# Altium schematic sheet Microcontroller_STM32F1011.SchDoc: Microcontroller STM32F101
size A4
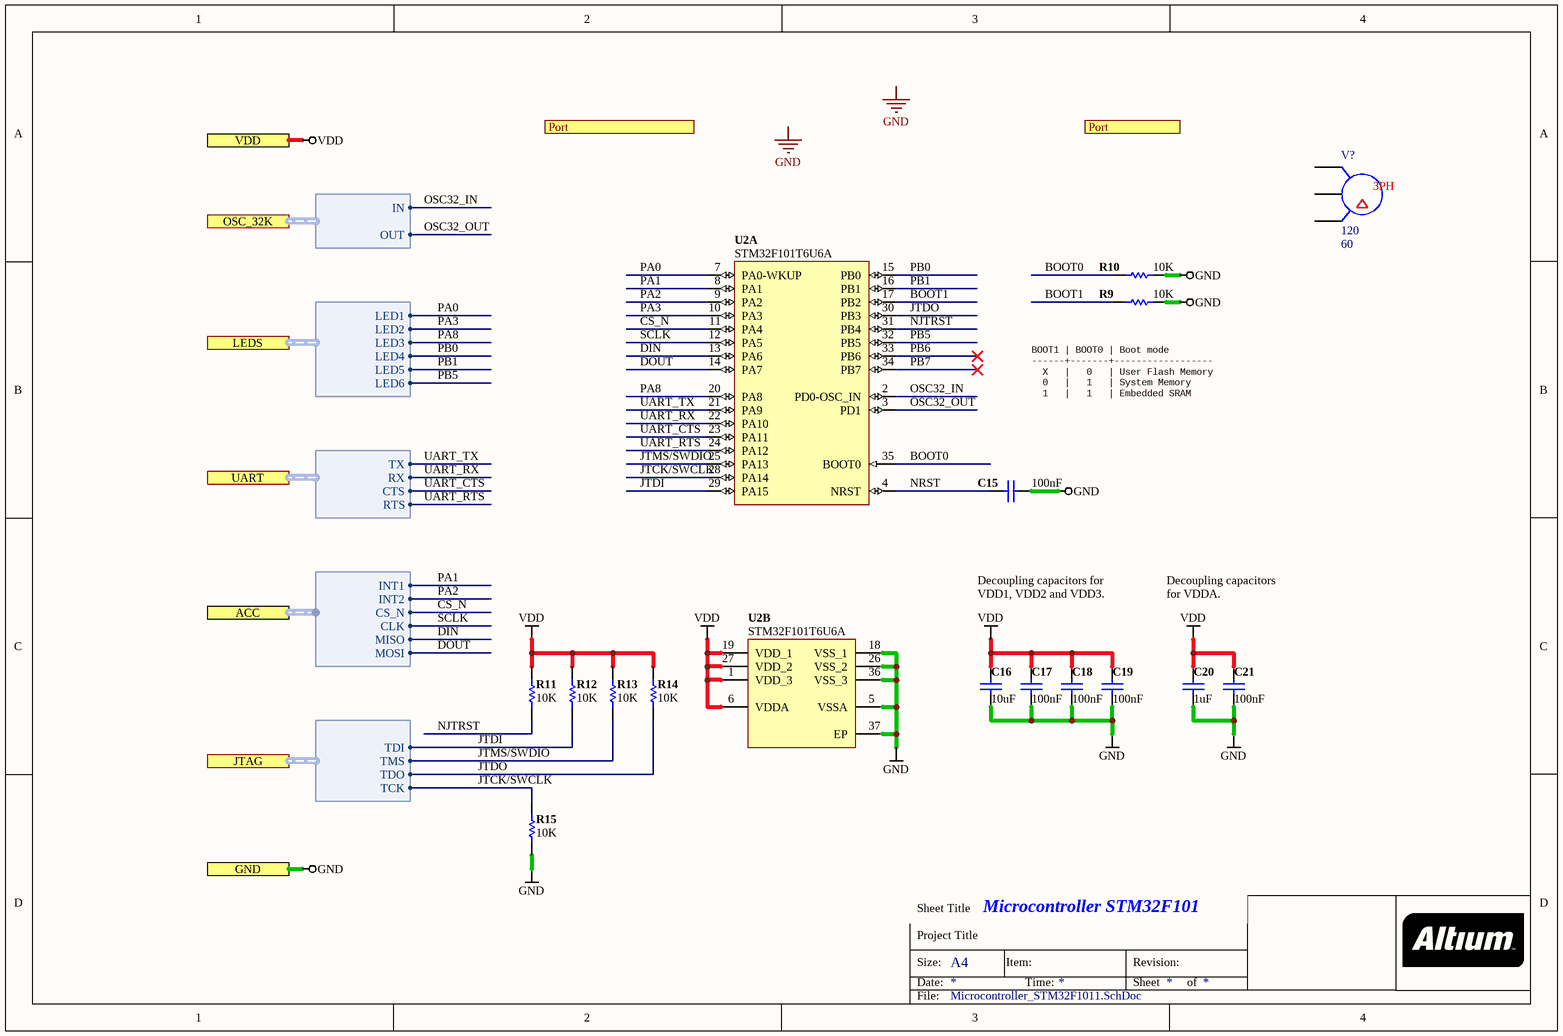
[diagram p0: Microcontroller_STM32F1011.SchDoc]

## Parts
C15  value 100nF  [CAPC0402(1005)60_N]  (hidden comment: CAP 100nF 6.3V 0402(1005))
C16  value 10uF  [CAPC0603(1608)100_N]  (hidden comment: CAP 10uF 10V 0603(1608))
C17  value 100nF  [CAPC0402(1005)60_N]  (hidden comment: CAP 100nF 6.3V 0402(1005))
C18  value 100nF  [CAPC0402(1005)60_N]  (hidden comment: CAP 100nF 6.3V 0402(1005))
C19  value 100nF  [CAPC0402(1005)60_N]  (hidden comment: CAP 100nF 6.3V 0402(1005))
C20  value 1uF  [CAPC0402(1005)60_N]  (hidden comment: CAP 1uF 6.3V 0402(1005))
C21  value 100nF  [CAPC0402(1005)60_N]  (hidden comment: CAP 100nF 6.3V 0402(1005))
R9  value 10K  [RESC0402(1005)_N]  (hidden comment: 10K 5% 0402(1005))
R10  value 10K  [RESC0402(1005)_N]  (hidden comment: 10K 5% 0402(1005))
R11  value 10K  [RESC0402(1005)_N]  (hidden comment: 10K 5% 0402(1005))
R12  value 10K  [RESC0402(1005)_N]  (hidden comment: 10K 5% 0402(1005))
R13  value 10K  [RESC0402(1005)_N]  (hidden comment: 10K 5% 0402(1005))
R14  value 10K  [RESC0402(1005)_N]  (hidden comment: 10K 5% 0402(1005))
R15  value 10K  [RESC0402(1005)_N]  (hidden comment: 10K 5% 0402(1005))
U2  STM32F101T6U6A  [VFQFPN36_N]  (parts A,B of 2)
V?  V_RMS: 120  FREQ: 60  (hidden comment: 3-Phase Delta Voltage Source)

## Ports
ACC (harness SPI_LIS331), GND, JTAG (harness JTAG), LEDS (harness LEDx6), OSC_32K (harness OSC), Port, UART (harness UART_HS), VDD

## Harnesses
JTAG: TMS, TCK, TDI, TDO
UART_HS: RX, RTS, TX, CTS
OSC: OUT, IN
LEDx6: LED1, LED2, LED3, LED4, LED5, LED6
SPI_LIS331: CLK, CS_N, MOSI, MISO, INT1, INT2

## Nets
GND: C15.2 C16.1 C17.1 C18.1 C19.1 C20.1 C21.1 R9.2 R10.2 R15.1 U2.5(VSSA) U2.18(VSS_1) U2.26(VSS_2) U2.36(VSS_3) U2.37(EP) ; port GND
VDD: C16.2 C17.2 C18.2 C19.2 C20.2 C21.2 R11.2 R12.2 R13.2 R14.2 U2.1(VDD_3) U2.6(VDDA) U2.19(VDD_1) U2.27(VDD_2) ; port VDD
BOOT0: R10.1 U2.35(BOOT0)
BOOT1: R9.1 U2.17(PB2)
CS_N: U2.11(PA4) ; port ACC.CS_N
DIN: U2.13(PA6) ; port ACC.MISO
DOUT: U2.14(PA7) ; port ACC.MOSI
JTCK/SWCLK: R15.2 U2.28(PA14) ; port JTAG.TCK
JTDI: R12.1 U2.29(PA15) ; port JTAG.TDI
JTDO: R14.1 U2.30(PB3) ; port JTAG.TDO
JTMS/SWDIO: R13.1 U2.25(PA13) ; port JTAG.TMS
NJTRST: R11.1 U2.31(PB4)
NRST: C15.1 U2.4(NRST)
OSC32_IN: U2.2(PD0-OSC_IN) ; port OSC_32K.IN
OSC32_OUT: U2.3(PD1) ; port OSC_32K.OUT
PA0: U2.7(PA0-WKUP) ; port LEDS.LED1
PA1: U2.8(PA1) ; port ACC.INT1
PA2: U2.9(PA2) ; port ACC.INT2
PA3: U2.10(PA3) ; port LEDS.LED2
PA8: U2.20(PA8) ; port LEDS.LED3
PB0: U2.15(PB0) ; port LEDS.LED4
PB1: U2.16(PB1) ; port LEDS.LED5
PB5: U2.32(PB5) ; port LEDS.LED6
PB6: U2.33(PB6)
PB7: U2.34(PB7)
SCLK: U2.12(PA5) ; port ACC.CLK
UART_CTS: U2.23(PA11) ; port UART.CTS
UART_RTS: U2.24(PA12) ; port UART.RTS
UART_RX: U2.22(PA10) ; port UART.RX
UART_TX: U2.21(PA9) ; port UART.TX

Not connected (* = marked no-connect by the designer): V? 1 2 3

## Notes on the sheet
- (near R9) BOOT1 | BOOT0 | Boot mode
  ------+-------+------------------
  X   |   0   | User Flash Memory
  0   |   1   | System Memory
  1   |   1   | Embedded SRAM
- Decoupling capacitors for VDD1, VDD2 and VDD3.
- Decoupling capacitors for VDDA.
- Labels drawn without touching a wire or pin: GND
- Sheet Title
- Project Title
- Size:
- Date:
- A4
- Item:
- Time:
- Revision:
- Sheet
- of
- File:
- (in symbol 3 Phase Delta) 3PH

## Library data of the parts
C15 C17-C19 C21 = CMP-1034-02060-1: CAP 100nF 6.3V ±5% 0402 (1005 Metric) Thickness 0.6mm SMD; Case-EIA: 0402; Case-Metric: 1005; Rated Voltage: 6.3 V; Max Thickness: 0.6 mm; Tolerance: ±5%; Technology: SMT
C16 = CMP-1035-02800-1: CAP 10uF 10V ±20% 0603 (1608 Metric) Thickness 1mm SMD; Case-EIA: 0603; Case-Metric: 1608; Tolerance: ±20%; Max Thickness: 1 mm; Rated Voltage: 10 V; Technology: SMT
C20 = CMP-1034-02113-1: CAP 1uF 6.3V ±10% 0402 (1005 Metric) Thickness 0.6mm SMD; Case-Metric: 1005; Case-EIA: 0402; Technology: SMT; Tolerance: ±10%; Rated Voltage: 6.3 V; Max Thickness: 0.6 mm
R9-R15 = CMP-1011-00098-1: 10K 0.063W 5% 0402 (1005 Metric)  SMD; Case-Metric: 1005; Case-EIA: 0402; Technology: SMT; Tolerance: 5 %; Power: 0.063 W
U2 = CMP-0237-00044-1: STM32 ARM-based 32-bit MCU Access Line with 32 kB Flash, 6 kB Internal RAM, Internal Code A, -40 to +85°C Temperature, 36-Pin VFQFPN, Tray; ComponentLink1URL: http://www.st.com/internet/com/TECHNICAL_RESOURCES/TECHNICAL_LITERATURE/DATASHEET/CD00210837.pdf; ComponentLink1Description: STM32F101 Datasheet; PackageDescription: 36-Pin Quad Flat No-Lead, 6 x 6 X 1.0 mm Body, 0.5 mm Pitch, Exposed Pad; ComponentLink2Description: STM32 Family Web Page; ComponentLink3Description: st.com Home; PackageReference: VFQFPN36; ComponentLink2URL: www.st.com/stm32; DatasheetVersion: rev5.0, Apr-2011; PackageVersion: 2011; ComponentLink3URL: http://www.st.com/internet/com/home/home.jsp
V? = 3 Phase Delta: SimulationGenericComponent: True